# Altium schematic sheet Switched_Power.SchDoc: Switched Power
size A4; Engineer: Rain Sarapuu; DocumentNumber: 7; Revision: 1; SheetNumber: 8; SheetTotal: 15
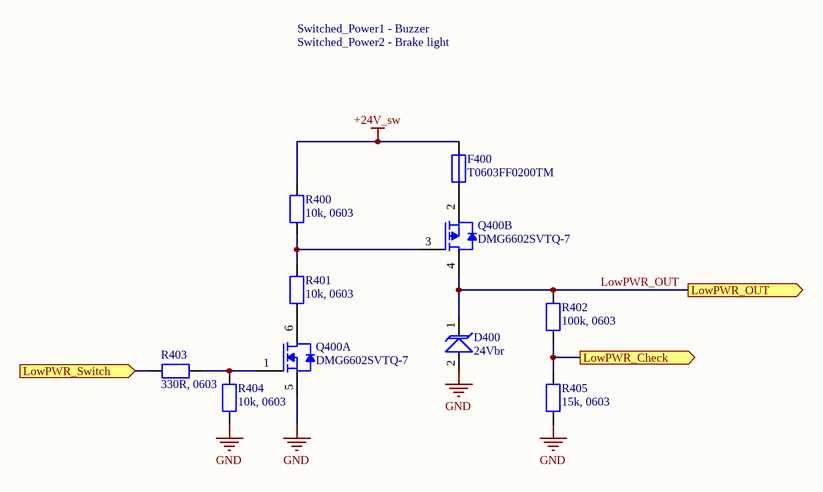
[diagram p0: Switched_Power.SchDoc]

## Parts
D400  24Vbr  [SOD-123W]
F400  T0603FF0200TM  [FUSE [0603] 1608]
Q400  DMG6602SVTQ-7  [SOT23-6]  (parts A,B of 2)
R400  10k, 0603  [RES [0603] 1608]
R401  10k, 0603  [RES [0603] 1608]
R402  100k, 0603  [RES [0603] 1608]
R403  330R, 0603  [RES [0603] 1608]
R404  10k, 0603  [RES [0603] 1608]
R405  15k, 0603  [RES [0603] 1608]

## Ports
LowPWR_Check (out), LowPWR_OUT (out), LowPWR_Switch (in)

## Nets
+24V_sw: F400.2 R400.2
GND: D400.2(A) Q400.5(S) R404.1 R405.1
LowPWR_Check: R402.1 R405.2 ; port LowPWR_Check
LowPWR_OUT: D400.1(K) Q400.4(D) R402.2 ; port LowPWR_OUT
LowPWR_Switch: R403.2 ; port LowPWR_Switch
NetF400_1: F400.1 Q400.2(S)
NetQ400_1: Q400.1(G) R403.1 R404.2
NetQ400_3: Q400.3(G) R400.1 R401.2
NetQ400_6: Q400.6(D) R401.1

## Notes on the sheet
- Switched_Power1 - Buzzer
  Switched_Power2 - Brake light
- Engineer:
- Date:
- Rev:

## Library data of the parts
D400 = CMP-004-00014-3: Trans Voltage Suppressor Diode, 400W, 24V V(RWM), Unidirectional, 1 Element, Silicon; Manufacturer Part Number: PTVS24VS1UR,115; Manufacturer: Nexperia; Supplier Part Number: 1829247; Datasheet: https://4donline.ihs.com/images/VipMasterIC/IC/NEXP/NEXP-S-A0003507774/NEXP-S-A0003507774-1.pdf?hkey=6D3A4C79FDBF58556ACFDE234799DDF0; Supplier: Farnell
F400 = CMP-005-00007-2: Fuse, Very Fast Act, 0.2A, 65VDC, 0603 Rohs Compliant: Yes; Supplier Part Number: 3701343; Manufacturer Part Number: T0603FF0200TM; Supplier: Farnell
Q400 = CMP-013-00015-1: Small Signal Field-Effect Transistor, 2.7A I(D), 30V, 2-Element, N-Channel and P-Channel, Silicon, Metal-oxide Semiconductor FET; Supplier Part Number: 621-DMG6602SVTQ-7; Supplier: Mouser; Manufacturer Part Number: DMG6602SVTQ-7
R400-R405 = CMP-009-00038-12: Standard resistor part; Supplier Part Number: *; Manufacturer Part Number: *; Supplier: *